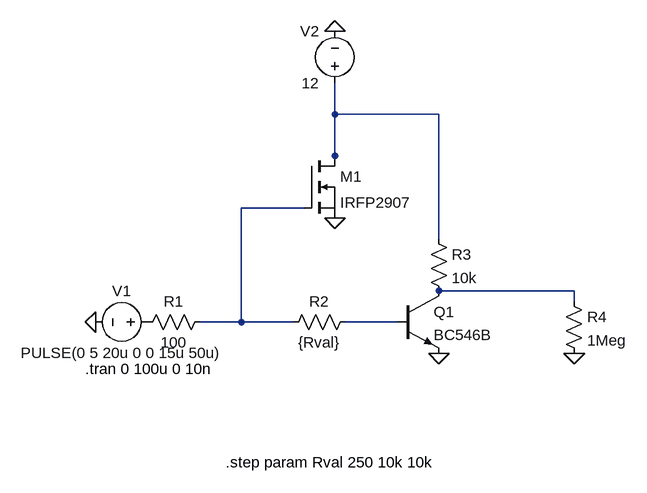
[diagram p0: schematic Simulering af delay problem + fix.asc]
Simulering af delay problem + fix.asc, the LTspice schematic file:
Version 4.1
SHEET 1 2216 680
WIRE 368 -128 368 -176
WIRE 528 -128 368 -128
WIRE 368 -64 368 -128
WIRE 368 -48 368 -64
WIRE 320 16 224 16
WIRE 528 64 528 -128
WIRE 736 144 528 144
WIRE 736 160 736 144
WIRE 224 192 224 16
WIRE 224 192 160 192
WIRE 304 192 224 192
WIRE 464 192 384 192
FLAG 528 240 0
FLAG 368 32 0
FLAG 0 192 0
FLAG 368 -256 0
FLAG 736 240 0
SYMBOL res 176 176 R90
WINDOW 0 0 56 VBottom 2
WINDOW 3 32 56 VTop 2
SYMATTR InstName R1
SYMATTR Value 100
SYMBOL res 400 176 R90
WINDOW 0 0 56 VBottom 2
WINDOW 3 32 56 VTop 2
SYMATTR InstName R2
SYMATTR Value {Rval}
SYMBOL npn 464 144 R0
SYMATTR InstName Q1
SYMATTR Value BC546B
SYMBOL nmos 320 -64 R0
SYMATTR InstName M1
SYMATTR Value IRFP2907
SYMBOL res 512 48 R0
SYMATTR InstName R3
SYMATTR Value 10k
SYMBOL voltage 96 192 R90
WINDOW 0 -32 56 VBottom 2
WINDOW 3 32 56 VTop 2
WINDOW 123 0 0 Left 0
WINDOW 39 0 0 Left 0
SYMATTR InstName V1
SYMATTR Value PULSE(0 5 20u 0 0 15u 50u)
SYMBOL voltage 368 -160 R180
WINDOW 0 24 96 Left 2
WINDOW 3 24 16 Left 2
WINDOW 123 0 0 Left 0
WINDOW 39 0 0 Left 0
SYMATTR InstName V2
SYMATTR Value 12
SYMBOL res 720 144 R0
SYMATTR InstName R4
SYMATTR Value 1Meg
TEXT -16 264 Left 2 !.tran 0 100u 0 10n
TEXT 200 408 Left 2 !.step param Rval 250 10k 10k

The netlist it stands for:
* Simulering af delay problem + fix.asc
R1 N002 P001 100
R2 N004 N002 {Rval}
Q1 N003 N004 0 0 BC546B
M1 N001 N002 0 0 IRFP2907
R3 N001 N003 10k
V1 P001 0 PULSE(0 5 20u 0 0 15u 50u)
V2 N001 0 12
R4 N003 0 1Meg
.model NPN NPN
.model PNP PNP
.lib standard.bjt
.model NMOS NMOS
.model PMOS PMOS
.lib standard.mos
.tran 0 100u 0 10n
.step param Rval 250 10k 10k
.backanno
.end